# Altium schematic sheet Interface.SchDoc
size A; SheetNumber: 4; SheetTotal: 7
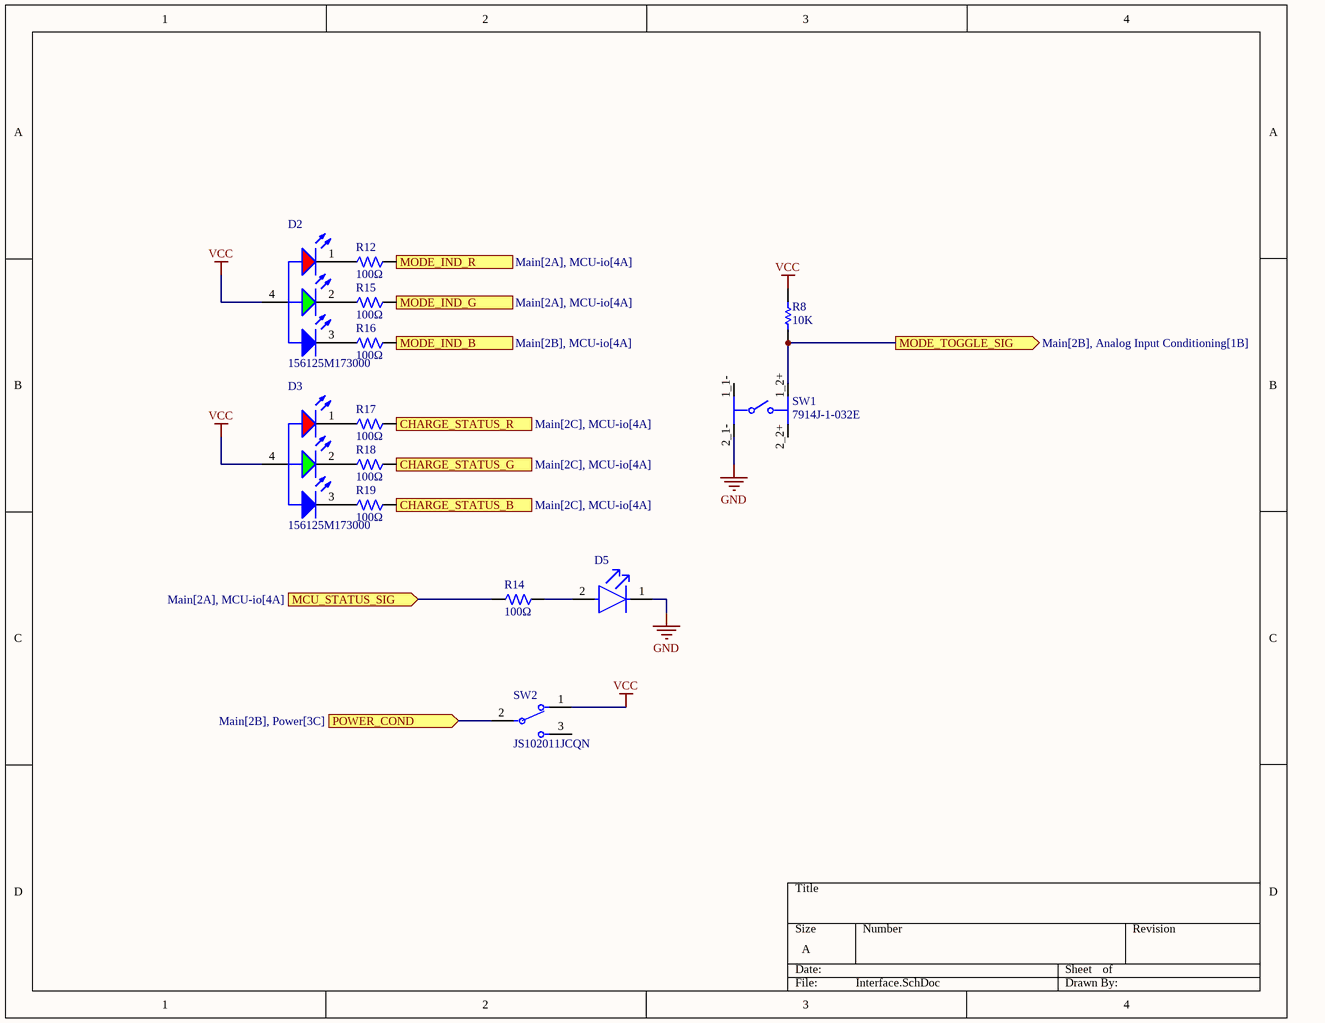
[diagram p0: Interface.SchDoc]

## Parts
D2  156125M173000  [WL-SFRW_1205_reverse use]
D3  156125M173000  [WL-SFRW_1205_reverse use]
D5  LTST-C193TBKT-5A  [FP-LTST-C193TBKT-5A-MFG]  (value not drawn)
R8  10K  [RES_SM0603_YAGEORC_N]
R12  Resistance: 100Ω  [RES-0603]  (hidden comment: 0603WAF1000T5E)
R14  Resistance: 100Ω  [RES-0603]  (hidden comment: 0603WAF1000T5E)
R15  Resistance: 100Ω  [RES-0603]  (hidden comment: 0603WAF1000T5E)
R16  Resistance: 100Ω  [RES-0603]  (hidden comment: 0603WAF1000T5E)
R17  Resistance: 100Ω  [RES-0603]  (hidden comment: 0603WAF1000T5E)
R18  Resistance: 100Ω  [RES-0603]  (hidden comment: 0603WAF1000T5E)
R19  Resistance: 100Ω  [RES-0603]  (hidden comment: 0603WAF1000T5E)
SW1  7914J-1-032E  [FP-7914J-1-032E-MFG]
SW2  JS102011JCQN  [FP-JS102011JCQN-MFG]

## Ports
CHARGE_STATUS_B (in, see Main[2C], MCU-io[4A]), CHARGE_STATUS_G (in, see Main[2C], MCU-io[4A]), CHARGE_STATUS_R (in, see Main[2C], MCU-io[4A]), MCU_STATUS_SIG (in, see Main[2A], MCU-io[4A]), MODE_IND_B (in, see Main[2B], MCU-io[4A]), MODE_IND_G (in, see Main[2A], MCU-io[4A]), MODE_IND_R (in, see Main[2A], MCU-io[4A]), MODE_TOGGLE_SIG (out, see Main[2B], Analog Input Conditioning[1B]), POWER_COND (in, see Main[2B], Power[3C])

## Nets
GND: D5.1(C) SW1.2_1-(2_1-)
VCC: D2.4(A) D3.4(A) R8.2 SW2.1
CHARGE_STATUS_B: R19.2 ; port CHARGE_STATUS_B
CHARGE_STATUS_G: R18.2 ; port CHARGE_STATUS_G
CHARGE_STATUS_R: R17.2 ; port CHARGE_STATUS_R
MCU_STATUS_SIG: R14.1 ; port MCU_STATUS_SIG
MODE_IND_B: R16.2 ; port MODE_IND_B
MODE_IND_G: R15.2 ; port MODE_IND_G
MODE_IND_R: R12.2 ; port MODE_IND_R
MODE_TOGGLE_SIG: R8.1 SW1.1_2+(1_2+) ; port MODE_TOGGLE_SIG
POWER_COND: SW2.2 ; port POWER_COND
NetD2_1: D2.1(K) R12.1
NetD2_2: D2.2(K) R15.1
NetD2_3: D2.3(K) R16.1
NetD3_1: D3.1(K) R17.1
NetD3_2: D3.2(K) R18.1
NetD3_3: D3.3(K) R19.1
NetD5_2: D5.2(A) R14.2

Not connected (* = marked no-connect by the designer): SW1 1_1-(1_1-) 2_2+(2_2+); SW2 3

## Library data of the parts
D2 D3 = CMP-207942-000006-2: LED RGB CLEAR 4SMD BOTTOM ENTRY; NexarPartId: 82270997; Max Reverse Voltage (DC): 5V; Color: Blue, Green, Red; Forward Current: 40mA; Viewing Angle: 120°; Luminous Intensity: 70mcd; Forward Voltage: 2V; Dominant Wavelength: 525nm; Power Dissipation: 48mW; Peak Wavelength: 468nm; Packaging: Tape and Reel; RoHS: Compliant; Reverse Voltage: 5V; Height: 800µm; Width: 1.2mm; Length: 3.2mm; Max Operating Temperature: 85°C; Min Operating Temperature: -40°C
D5 = CMP-2000-06624-2: LED BLUE CLEAR CHIP SMD; Number of Elements: 1; Forward Voltage: 2.8V; Forward Current: 20mA; Test Current: 5mA; Lens Color: Colorless; Dominant Wavelength: 475nm; Reverse Voltage: 5V; Viewing Angle: 130°; Lens Style: Diffused; Luminous Intensity: 15mcd; Power Dissipation: 76mW; Max Operating Temperature: 80°C; Length: 1.6mm; Number of LEDs: 1; Case/Package: 0603; Case Code (Metric): 1608; Number of Pins: 2; Radiation Hardening: No; Min Operating Temperature: -20°C; Width: 0.8mm; Packaging: Tape and Reel; Package Quantity: 1; Lead Free: Lead Free; Lens Transparency: Clear; Illumination Color: Blue; Color: Blue; RoHS Compliant: Yes; Mount: Surface Mount; Depth: 0.8mm; Case Code (Imperial): 0603; Height: 0.35mm
R8 = RC0603FR-0710KL: RES 10K SM0603 YAGEO RC_L; Power (Watts): 0.1; Resistance (Ohms): 10000; Tolerance (%): 1; Category: Resistor; Manufacturer: Yageo; Manufacturer Part Number: RC0603FR-0710KL; Package: 0603; Value: 10K; Supplier Part Number 1: 9238603; Supplier 1: Farnell; ComponentLink1URL: http://www.yageo.com; ComponentLink1Description: Manufacturer Website; Supplier 2: Digi-Key; Supplier Part Number 2: 311-10.0KHRCT-ND
R12 R14-R19 = 0603WAF1000T5E: Resistor, 100Ω, ±1%, 100mW, 75V, ±200ppm/℃, -55℃~+155℃, SMD 0603; Manufacturer: Uniroyal; Supplier 1: LCSC; Manufacturer Part Number: 0603WAF1000T5E; Supplier Part Number 1: C22775; JLCPCB Part Number: C22775; Power Rating: 100mW; Category: Resistors; Package Size: 0603; JLCPCB Basic Part: Yes; Tolerance: ±1%; Voltage Rating: 75V; Temperature Coefficient: ±200ppm/℃; Temperature Rating: -55℃~+155℃; ComponentLink1Description: Datasheet; ComponentLink1URL: https://wmsc.lcsc.com/wmsc/upload/file/pdf/v2/lcsc/2206010130_UNI-ROYAL-Uniroyal-Elec-0603WAF1000T5E_C22775.pdf; ComponentLink2Description: JLCPCB Part URL; ComponentLink2URL: https://jlcpcb.com/partdetail/C22775
SW1 = CMP-07427-000009-1: SWITCH TACTILE SPST-NO 0.1A 16V; Switch Function: Off-Mom; Throw Configuration: SPST; Max Current Rating: 100mA; Illumination Type: Non-Illuminated; Actuator Type: Standard; Operating Force: 2.94N; Mechanical Life: 100000Cycles; Actuator Material: Rubber; Series: 7914; Orientation: Straight; Max Operating Temperature: 125°C; Case/Package: SMD/SMT; Length: 5mm; Contact Plating: Silver; Depth: 5mm; Min Operating Temperature: -55°C; RoHS Compliant: Yes; Current Rating: 100mA; Contact Material: Gold; Packaging: Tape and Reel; Max Voltage Rating (DC): 16V; Termination: J-Hook; Voltage Rating (DC): 16V; Mount: Surface Mount; Package Quantity: 1
SW2 = CMP-10038-000010-1: SWITCH SLIDE SPDT 300MA 6V; Electrical Life: 5000Cycles; Switch Function: On-On; Actuator Material: Nylon; Actuator Length: 2mm; Actuator Type: Standard; Current Rating: 300mA; Voltage Rating (DC): 6V; Min Operating Temperature: -40°C; Throw Configuration: SPDT; Mount: Surface Mount; Switch Travel: 2mm; Max Operating Temperature: 85°C; Packaging: Cut Tape; Contact Plating: Silver; Contact Material: Copper Alloy